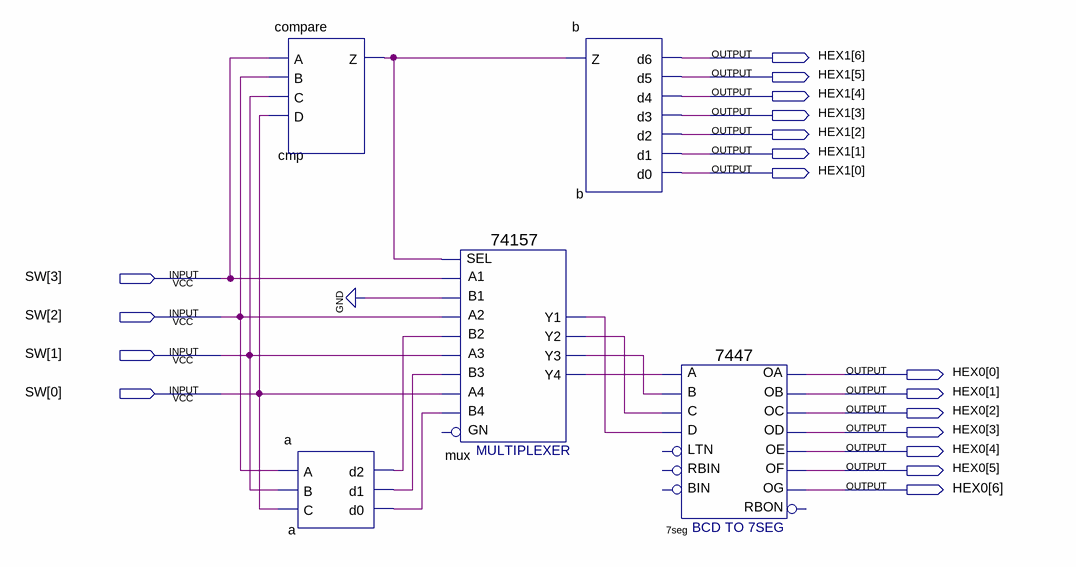
[diagram p0: schematic sheet]
// Quartus schematic 3.bdf as structural Verilog: 5 symbols, 18 pins
module \3  (
  input  [3:0] SW,
  output [6:0] HEX1,
  output [6:0] HEX0
);

  wire a_d0, a_d1, a_d2, cmp_z, mux_y1, mux_y2, mux_y3, mux_y4;

  compare cmp (.A(SW[3]), .B(SW[2]), .C(SW[1]), .D(SW[0]), .Z(cmp_z));
  a a (.A(SW[2]), .B(SW[1]), .C(SW[0]), .d2(a_d2), .d1(a_d1), .d0(a_d0));
  \74157  mux (
    .A1(SW[3]), .B1(1'b0), .SEL(cmp_z), .B2(a_d2), .A3(SW[1]), .B3(a_d1), .A2(SW[2]), .B4(a_d0), .A4(SW[0]),
    .Y2(mux_y2), .Y1(mux_y1), .Y4(mux_y4), .Y3(mux_y3));  // open: GN
  b b (.Z(cmp_z), .d6(HEX1[6]), .d5(HEX1[5]), .d4(HEX1[4]), .d3(HEX1[3]), .d2(HEX1[2]), .d1(HEX1[1]), .d0(HEX1[0]));
  \7447  u_7seg (
    .B(mux_y3), .C(mux_y2), .D(mux_y1), .A(mux_y4), .OB(HEX0[1]), .OC(HEX0[2]), .OE(HEX0[4]), .OD(HEX0[3]),
    .OF(HEX0[5]), .OG(HEX0[6]), .OA(HEX0[0]));  // open: LTN, RBIN, BIN, RBON
endmodule
